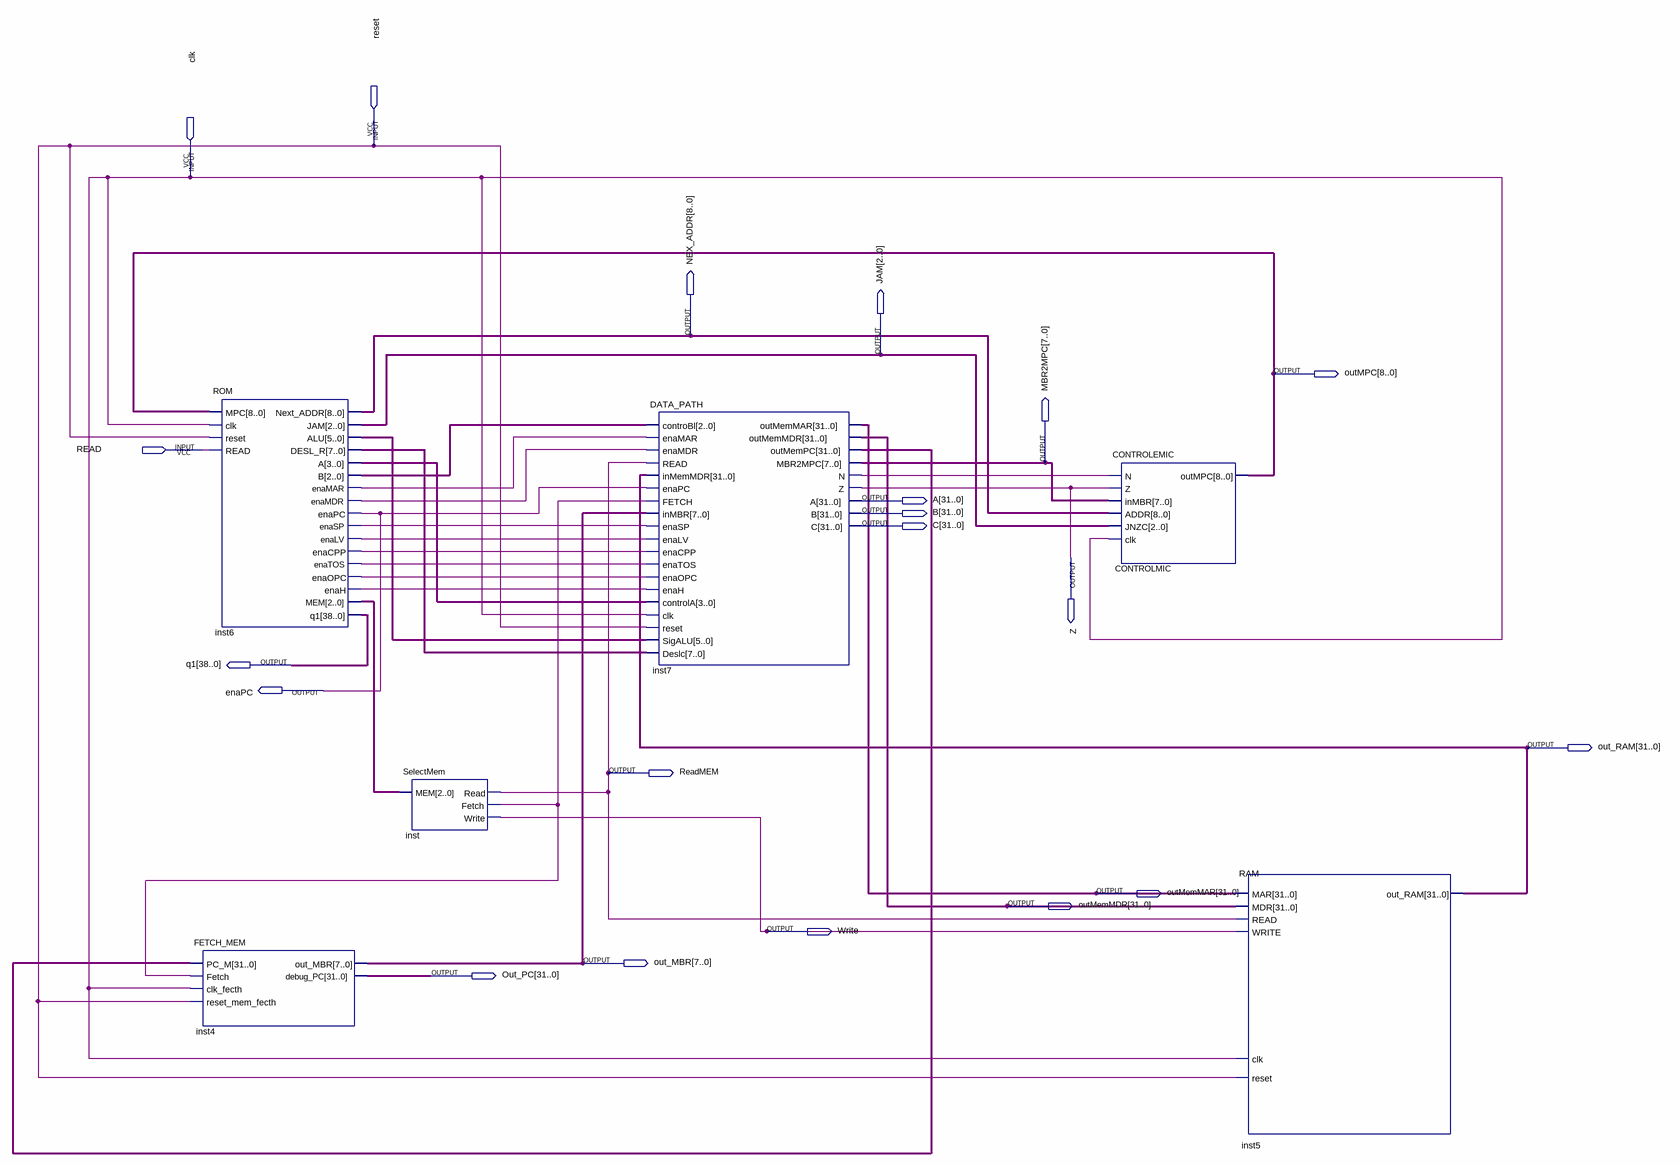
[diagram p0: schematic sheet]
// Quartus schematic MIC2.bdf as structural Verilog: 6 symbols, 20 pins
module MIC2 (
  input  reset,
  input  clk,
  input  READ,
  output [8:0] NEX_ADDR,
  output [2:0] JAM,
  output [8:0] outMPC,
  output [7:0] MBR2MPC,
  output [31:0] A,
  output [31:0] B,
  output [31:0] C,
  output Z,
  output [38:0] q1,
  output enaPC,
  output [31:0] out_RAM,
  output ReadMEM,
  output [31:0] outMemMAR,
  output [31:0] outMemMDR,
  output Write,
  output [7:0] out_MBR,
  output [31:0] Out_PC
);

  wire inst6_enacpp, inst6_enah, inst6_enalv, inst6_enamar, inst6_enamdr, inst6_enaopc, inst6_enasp,
       inst6_enatos, inst7_n, inst_fetch;
  wire [2:0] inst6_b, inst6_mem;
  wire [3:0] inst6_a;
  wire [5:0] inst6_alu;
  wire [7:0] inst6_desl_r;
  wire [31:0] inst7_outmempc;

  FETCH_MEM inst4 (
    .PC_M(inst7_outmempc), .Fetch(inst_fetch), .clk_fecth(clk), .reset_mem_fecth(reset), .out_MBR(out_MBR),
    .debug_PC(Out_PC));
  ROM inst6 (
    .MPC(outMPC), .clk(clk), .reset(reset), .READ(READ), .Next_ADDR(NEX_ADDR), .JAM(JAM), .ALU(inst6_alu),
    .DESL_R(inst6_desl_r), .A(inst6_a), .B(inst6_b), .enaMAR(inst6_enamar), .enaMDR(inst6_enamdr),
    .enaPC(enaPC), .enaSP(inst6_enasp), .enaLV(inst6_enalv), .enaCPP(inst6_enacpp), .enaTOS(inst6_enatos),
    .enaOPC(inst6_enaopc), .enaH(inst6_enah), .MEM(inst6_mem), .q1(q1));
  SelectMem inst (.MEM(inst6_mem), .Read(ReadMEM), .Fetch(inst_fetch), .Write(Write));
  DATA_PATH inst7 (
    .controBl(inst6_b), .enaMAR(inst6_enamar), .enaMDR(inst6_enamdr), .READ(ReadMEM), .inMemMDR(out_RAM),
    .enaPC(enaPC), .FETCH(inst_fetch), .inMBR(out_MBR), .enaSP(inst6_enasp), .enaLV(inst6_enalv),
    .enaCPP(inst6_enacpp), .enaTOS(inst6_enatos), .enaOPC(inst6_enaopc), .enaH(inst6_enah),
    .controlA(inst6_a), .clk(clk), .reset(reset), .SigALU(inst6_alu), .Deslc(inst6_desl_r),
    .outMemPC(inst7_outmempc), .MBR2MPC(MBR2MPC), .N(inst7_n), .Z(Z), .A(A), .B(B), .C(C),
    .outMemMDR(outMemMDR), .outMemMAR(outMemMAR));
  CONTROLEMIC CONTROLMIC (.N(inst7_n), .Z(Z), .inMBR(MBR2MPC), .ADDR(NEX_ADDR), .JNZC(JAM), .clk(clk), .outMPC(outMPC));
  RAM inst5 (
    .MAR(outMemMAR), .MDR(outMemMDR), .READ(ReadMEM), .WRITE(Write), .clk(clk), .reset(reset),
    .out_RAM(out_RAM));
endmodule
